# EAGLE design frontpanel_prototype (EAGLE 6.6.0)
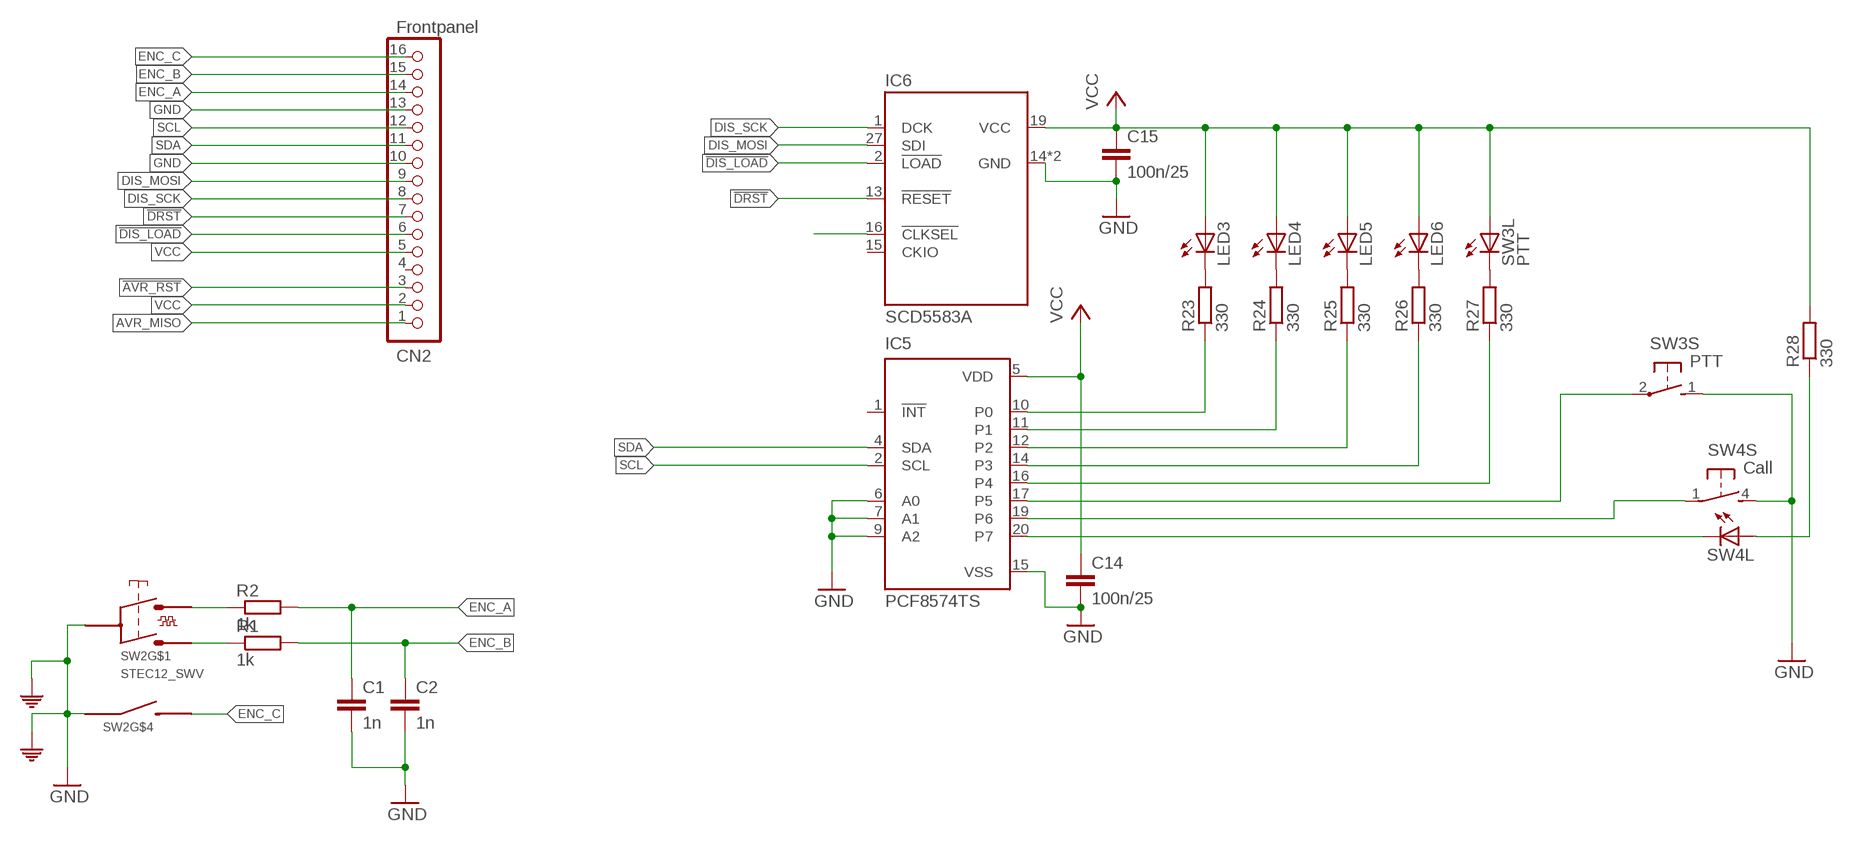
[diagram p0: schematic, sheet 1]

## Parts
C1  1n  C-EUC0603  [C0603]
C2  1n  C-EUC0603  [C0603]
C14  100n/25  C-EUC0603  [C0603]
C15  100n/25  C-EUC0603  [C0603]
CN2  Frontpanel  MOLEX-505278-1633  [MOLEX-505278-1633]
IC5  PCF8574TS  [SSOP20]
IC6  SCD5583A  [SCD558XA]
LED3  LEDLZR181  [LZR181]
LED4  LEDLZR181  [LZR181]
LED5  LEDLZR181  [LZR181]
LED6  LEDLZR181  [LZR181]
R1  1k  R-EU_R0603  [R0603]
R2  1k  R-EU_R0603  [R0603]
R23  330  R-EU_R0603  [R0603]
R24  330  R-EU_R0603  [R0603]
R25  330  R-EU_R0603  [R0603]
R26  330  R-EU_R0603  [R0603]
R27  330  R-EU_R0603  [R0603]
R28  330  R-EU_R0603  [R0603]
SW2  STEC12_SWV  [STEC12_VERT]
SW3  PTT  6425-0101  [6425]
SW4  Call  5GSH9_LED  [MEC_5G_LED]

## Nets
!AVR_RST!: CN2.3
!DIS_LOAD!: CN2.6 IC6.2(!LOAD!)
!DRST!: CN2.7 IC6.13(!RESET!)
AVR_MISO: CN2.1
DIS_MOSI: CN2.9 IC6.27(SDI)
DIS_SCK: CN2.8 IC6.1(DCK)
ENC_A: C1.1 CN2.14 R2.2
ENC_B: C2.1 CN2.15 R1.2
ENC_C: CN2.16 SW2.Y
GND: C1.2 C2.2 C14.2 C15.2 CN2.10 CN2.13 IC5.6(A0) IC5.7(A1) IC5.9(A2) IC5.15(VSS) IC6.14(GND) IC6.28(GND) SW2.B SW2.G1 SW2.G2 SW2.X SW3.1(S:S) SW4.4(S:S)
N$1: R2.1 SW2.A
N$2: R1.1 SW2.C
N$3: IC6.16(!CLKSEL!)
N$19: R27.2 SW3.K(L:C)
N$21: LED3.K(C) R23.2
N$26: R28.1 SW4.3(L:A)
N$27: IC5.19(P6) SW4.1(S:P)
N$29: IC5.20(P7) SW4.2(L:C)
N$30: IC5.17(P5) SW3.2(S:P)
N$39: LED4.K(C) R24.2
N$40: LED5.K(C) R25.2
N$41: LED6.K(C) R26.2
N$44: IC5.16(P4) R27.1
N$45: IC5.10(P0) R23.1
N$46: IC5.11(P1) R24.1
N$47: IC5.12(P2) R25.1
N$48: IC5.14(P3) R26.1
SCL: CN2.12 IC5.2(SCL)
SDA: CN2.11 IC5.4(SDA)
VCC: C14.1 C15.1 CN2.2 CN2.5 IC5.5(VDD) IC6.19(VCC) LED3.A LED4.A LED5.A LED6.A R28.2 SW3.A(L:A)
Unconnected: CN2.4 IC5.1(!INT) IC6.15(CKIO)

## Library data of the parts
C1 C2 C14 C15 = rcl:C-EU: CAPACITOR, European symbol
CN2 = mycon:MOLEX-505278-1633
IC5 = micro-philips:PCF8574: I2C-Bus Remote 8-bit I/O expander http://www.semiconductors.philips.com/acrobat_download/datasheets/PCF8574_4.pdf
IC6 = osram:SCD55
LED3-LED6 = led:LED: LED OSRAM: - CHIPLED LG R971, LG N971, LY N971, LG Q971, LY Q971, LO R971, LY R971 LH N974, LH R974 LS Q976, LO Q976, LY Q976 LO Q996 - Hyper CHIPLED LW Q18S LB Q993, LB Q99A, LB R99A - SideLED LS A670, LO A670, LY A670, LG A670, LP A670 LB A673, LV A673, LT A673, LW A673 LH A674 LY A675 LS A676, LA A676, LO A676, LY A676, LW A676 LS A679, LY A679, LG A679 - Hyper Micro SIDELED® LS Y876, LA Y876, LO Y876, LY Y876 LT Y87S - SmartLED LW L88C, LW L88S LB L89C, LB L89S, LG L890 LS L89K, LO L89K, LY L89K LS L896, LA L896, LO L896, LY L896 - TOPLED LS T670, LO T670, LY T670, LG T670, LP T670 LSG T670, LSP T670, LSY T670, LOP T670, LYG T670 LG T671, LOG T671, LSG T671 LB T673, LV T673, LT T673, LW T673 LH T674 LS T676, LA T676, LO T676, LY T676, LB T676, LH T676, LSB T676, LW T676 LB T67C, LV T67C, LT T67C, LS T67K, LO T67K, LY T67K, LW E67C LS E67B, LA E67B, LO E67B, LY E67B, LB E67C, LV E67C, LT E67C LW T67C LS T679, LY T679, LG T679 LS T770, LO T770, LY T770, LG T770, LP T770 LB T773, LV T773, LT T773, LW T773 LH T774 LS E675, LA E675, LY E675, LS T675 LS T776, LA T776, LO T776, LY T776, LB T776 LHGB T686 LT T68C, LB T68C - Hyper Mini TOPLED® LB M676 - Mini TOPLED Santana® LG M470 LS M47K, LO M47K, LY M47K Source: http://www.osram.convergy.de LUXEON: - LUMILED® LXK2-PW12-R00, LXK2-PW12-S00, LXK2-PW14-U00, LXK2-PW14-V00 LXK2-PM12-R00, LXK2-PM12-S00, LXK2-PM14-U00 LXK2-PE12-Q00, LXK2-PE12-R00, LXK2-PE12-S00, LXK2-PE14-T00, LXK2-PE14-U00 LXK2-PB12-K00, LXK2-PB12-L00, LXK2-PB12-M00, LXK2-PB14-N00, LXK2-PB14-P00, LXK2-PB14-Q00 LXK2-PR12-L00, LXK2-PR12-M00, LXK2-PR14-Q00, LXK2-PR14-R00 LXK2-PD12-Q00, LXK2-PD12-R00, LXK2-PD12-S00 LXK2-PH12-R00, LXK2-PH12-S00 LXK2-PL12-P00, LXK2-PL12-Q00, LXK2-PL12-R00 Source: www.luxeon.com KINGBRIGHT: KA-3528ASYC Source: www.kingbright.com
R1 R2 R23-R28 = rcl:R-EU_: RESISTOR, European symbol
SW2 = alps_encoder:STEC12_SW
SW3 = marquardt:6425-0101
SW4 = multimec:5GSH9_LED

## Board
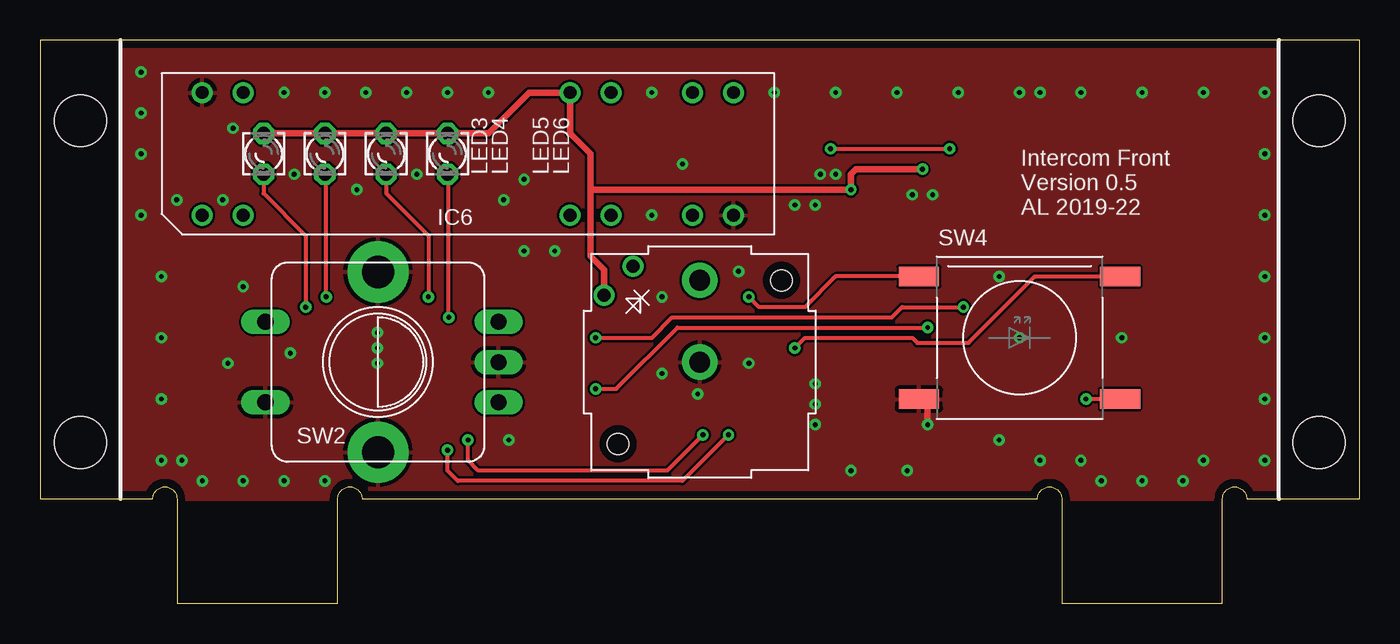
[diagram p1: board, top side]
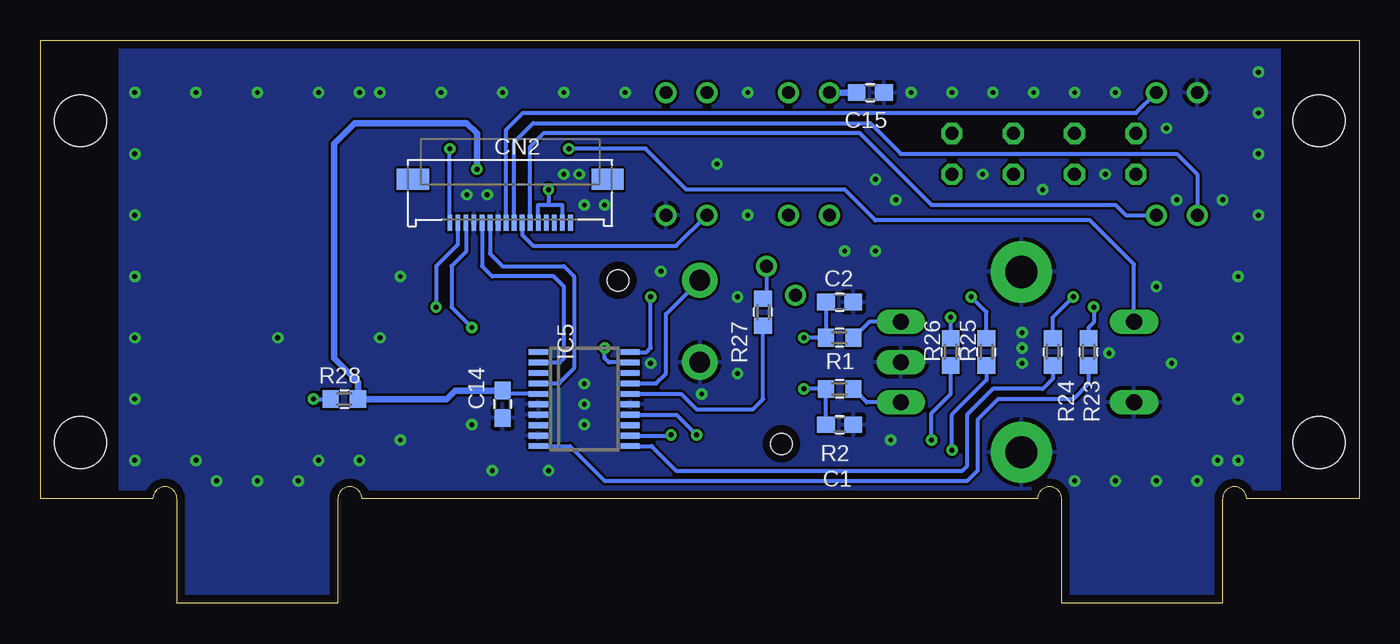
[diagram p2: board, bottom side, seen from below]

Size 82 x 35 mm. Coordinates in mm from the lower left corner, seen from the top.
Outline: 82,35 0,35 0,6.5 7,6.5 arc-90 7.75,7.25 arc-90 8.5,6.5 8.5,0 18.5,0 18.5,6.5 arc-90 19.25,7.25 arc-90 20,6.5 62,6.5 arc-90 62.75,7.25 arc-90 63.5,6.5 63.5,0 73.5,0 73.5,6.5 arc-90 74.25,7.25 arc-90 75,6.5 82,6.5 82,35
Copper layers (1*16): Top 0.035mm / dielectric 1.5mm / Bottom 0.035mm
Design rules "default *": minimum track width 6mil, minimum drill 0.3mm, track to track 6mil, track to pad 6mil, pad to pad 6mil, via to via 6mil, smd to smd 6mil, copper to edge 0.5mm, drill to drill 8mil, minimum pad ring 10mil, minimum via ring 8mil, stop-mask expansion 4mil, vias tented up to drill 0mil, thermal gap 10mil
Holes 3.2 mm at 2.5,30 2.5,10 79.5,30 79.5,10

### Footprints (pad centres in the part's own frame; a part is rotated, then mirrored left to right if it is on the bottom)
C0603 = smd 1.1 x 1: 1 -0.85,0; 2 0.85,0
MOLEX-505278-1633 = smd 0.3 x 1: 1 -3.75,1.75; 2 -3.25,1.75; 3 -2.75,1.75; 4 -2.25,1.75; 5 -1.75,1.75; 6 -1.25,1.75; 7 -0.75,1.75; 8 -0.25,1.75; 9 0.25,1.75; 10 0.75,1.75; 11 1.25,1.75; 12 1.75,1.75; 13 2.25,1.75; 14 2.75,1.75; 15 3.25,1.75; 16 3.75,1.75 | smd 2 x 1.3: T1 -6.05,-0.95; T2 6.05,-0.95
SSOP20 = smd 0.35 x 1.2: 1 -2.925,-2.85; 2 -2.275,-2.85; 3 -1.625,-2.85; 4 -0.975,-2.85; 5 -0.325,-2.85; 6 0.325,-2.85; 7 0.975,-2.85; 8 1.625,-2.85; 9 2.275,-2.85; 10 2.925,-2.85; 11 2.925,2.85; 12 2.275,2.85; 13 1.625,2.85; 14 0.975,2.85; 15 0.325,2.85; 16 -0.325,2.85; 17 -0.975,2.85; 18 -1.625,2.85; 19 -2.275,2.85; 20 -2.925,2.85
SCD558XA = drill 0.8: 1 -16.51,-3.81; 2 -13.97,-3.81; 10 6.35,-3.81; 11 8.89,-3.81; 13 13.97,-3.81; 14 16.51,-3.81; 15 16.51,3.81; 16 13.97,3.81; 18 8.89,3.81; 19 6.35,3.81; 27 -13.97,3.81; 28 -16.51,3.81
LZR181 = drill 0.813 octagon: A -1.27,0; K 1.27,0
R0603 = smd 1 x 1.1: 1 -0.85,0; 2 0.85,0
STEC12_VERT = drill 1 long: A -2.5,-7.5; B 0,-7.5; C 2.5,-7.5; X -2.5,7; Y 2.5,7 | drill 2 pad 3.81: G1 -5.6,0; G2 5.6,0
6425 = drill 1.3 pad 2.184: 1 0,0; 2 0,5.08 | drill 0.8: A -5.95,4.15; K -4.15,5.95 | hole 1.3: -5.08,-5.08; 5.08,5.08
MEC_5G_LED = smd 2.5 x 1.2: 1 6.25,3.81; 2 -6.25,3.81; 3 6.25,-3.81; 4 -6.25,-3.81

### Placement (x,y rotation side)
C1  32.3,11.11 0 bottom
C2  32.3,18.73 0 bottom
C14  53.26,12.38 270 bottom
C15  30.4,31.75 0 bottom
CN2  52.79,25.4 180 bottom
IC5  48.18,12.7 270 bottom
IC6  26.59,27.94 0 top
LED3  13.89,27.94 270 top
LED4  17.7,27.94 270 top
LED5  21.51,27.94 270 top
LED6  25.32,27.94 270 top
R1  32.3,16.51 180 bottom
R2  32.3,13.34 180 bottom
R23  16.83,15.64 90 bottom
R24  19.05,15.64 90 bottom
R25  23.18,15.64 90 bottom
R26  25.4,15.64 90 bottom
R27  37.07,18.1 90 bottom
R28  63.1,12.7 0 bottom
SW2  21,15 90 top
SW3  41,15 0 top
SW4  60.88,16.51 0 top

### Tracks (layer width: path | path; a pad name or v marks a point on that pad's centre or on a via)
!DIS_LOAD!
  Bottom 0.254: CN2.6 51.54,28.39 50.72,29.21 31.04,29.21 26.59,24.77 15.16,24.77 14.53,24.13 IC6.2
!DRST!
  Bottom 0.254: CN2.7 52.04,22.91 51.35,22.23 42.47,22.23 IC6.13
DIS_MOSI
  Bottom 0.254: CN2.9 53.04,29.43 51.99,30.48 13.89,30.48 IC6.27
DIS_SCK
  Bottom 0.254: CN2.8 52.54,28.66 51.35,29.84 30.4,29.84 28.5,27.94 11.35,27.94 10.08,26.67 IC6.1
ENC_A  (via drill 0.3)
  Top 0.254: v34.53,13.34 35.8,13.34 39.61,17.14 v55.16,17.14
  Bottom 0.254: C1.1 R2.2 v34.53,13.34 | CN2.14 55.54,21.85 56.44,20.95 56.44,18.41 v55.16,17.14
ENC_B  (via drill 0.3)
  Top 0.254: v34.53,16.51 38.02,16.51 39.29,17.78 52.94,17.78 53.58,18.41 v57.39,18.41
  Bottom 0.254: v34.53,16.51 R1.2 C2.1 | CN2.15 56.04,22.3 57.39,20.95 v57.39,18.41
ENC_C  (via drill 0.3)
  Top 0.254: v49.13,28.26 v56.54,28.26
  Bottom 0.254: SW2.Y 14,21.07 16.75,23.81 30.08,23.81 31.99,25.72 41.83,25.72 44.37,28.26 v49.13,28.26 | CN2.16 v56.54,28.26
GND  (via drill 0.3)
  Top 0.406: SW4.4 54.85,12.7 55.16,12.38 v55.16,11.11
  other vias: 10.08,7.62 12.62,7.62 15.16,7.62 17.7,7.62 29.13,10.16 38.66,14.29 38.66,19.05 43.42,20.64 40.88,13.02 44.05,14.92 48.18,13.65 48.18,12.38 48.18,11.11 50.4,8.26 53.9,8.26 65.96,7.62 68.5,7.62 71.04,7.62 67.23,16.51 60.88,16.51 59.61,20.32 59.61,10.16 54.21,25.4 55.48,25.4 48.5,26.67 49.45,26.67 48.18,24.77 46.91,24.77 39.92,27.3 38.02,24.13 30.08,26.35 30.08,21.91 31.99,21.91 28.81,25.08 23.41,26.67 15.79,26.67 11.98,29.53 11.35,25.08 6.27,27.94 6.27,30.48 6.27,33.02 15.16,31.75 17.7,31.75 20.24,31.75 22.78,31.75 25.32,31.75 27.86,31.75 38.02,31.75 45.64,31.75 49.45,31.75 53.26,31.75 57.07,31.75 62.15,31.75 60.88,31.75 64.69,31.75 68.5,31.75 72.31,31.75 76.12,31.75 76.12,27.94 76.12,24.13 76.12,20.32 76.12,16.51 76.12,12.7 76.12,8.89 72.31,8.89 64.69,8.89 62.15,8.89 7.54,8.89 8.81,8.89 12.62,19.68 11.67,14.92 7.54,12.7 8.49,25.08 19.68,25.72 20.95,14.92 20.95,15.88 20.95,16.83 15.56,15.56 7.54,16.51 7.54,20.32 6.27,24.13
  pour Bottom: 5,0 77,0 77,35 5,35
  pour Top: 5,6.5 77,6.5 77,35 5,35
N$1
  Bottom 0.254: SW2.A 30.62,12.5 R2.1
N$2
  Bottom 0.254: SW2.C 30.46,17.5 R1.1
N$19
  Bottom 0.254: SW3.K 36.85,19.16 R27.2
N$21  (via drill 0.3)
  Top 0.254: LED3.K 13.89,25.48 16.51,22.86 v16.51,18.41
  Bottom 0.254: v16.51,18.41 16.51,17.46 16.83,17.14 R23.2
N$26  (via drill 0.3)
  Top 0.254: SW4.3 v65.01,12.7
  Bottom 0.254: v65.01,12.7 R28.1
N$27  (via drill 0.3)
  Top 0.254: v46.91,15.88 47.55,16.51 54.21,16.51 54.53,16.19 57.7,16.19 61.83,20.32 SW4.1
  Bottom 0.254: IC5.19 46.65,14.97 46.91,15.24 v46.91,15.88
N$29  (via drill 0.3)
  Top 0.254: SW4.2 49.45,20.32 47.55,18.41 44.69,18.41 v44.05,19.05
  Bottom 0.254: IC5.20 44.3,15.62 44.05,15.88 v44.05,19.05
N$30
  Bottom 0.254: IC5.17 43.71,13.68 43.1,14.29 43.1,17.98 SW3.2
N$39  (via drill 0.3)
  Top 0.254: v17.78,19.05 17.78,26.59 LED4.K
  Bottom 0.254: R24.2 19.05,17.78 v17.78,19.05
N$40  (via drill 0.3)
  Top 0.254: LED5.K 21.51,25.48 24.13,22.86 v24.13,19.05
  Bottom 0.254: R25.2 23.18,18.1 v24.13,19.05
N$41  (via drill 0.3)
  Top 0.254: v25.4,17.78 25.4,26.59 LED6.K
  Bottom 0.254: R26.2 v25.4,17.78
N$44
  Bottom 0.254: IC5.16 42.16,13.03 41.2,12.06 37.7,12.06 37.07,12.7 R27.1
N$45
  Bottom 0.254: IC5.10 49.06,9.78 46.91,7.62 24.37,7.62 23.73,8.26 23.73,11.43 22.46,12.7 17.78,12.7 16.83,13.65 R23.1
N$46
  Bottom 0.254: IC5.11 43.98,9.78 42.47,8.26 24.68,8.26 24.37,8.57 24.37,11.75 22.78,13.34 19.68,13.34 19.05,13.97 R24.1
N$47  (via drill 0.3)
  Top 0.254: v42.78,10.48 39.92,7.62 25.95,7.62 25.32,8.26 v25.32,9.53
  Bottom 0.254: IC5.12 42.84,10.43 v42.78,10.48 | v25.32,9.53 25.32,11.75 23.18,13.89 R25.1
N$48  (via drill 0.3)
  Top 0.254: v41.2,10.48 38.97,8.26 27.23,8.26 26.59,8.89 v26.59,10.16
  Bottom 0.254: IC5.14 42.44,11.72 v41.2,10.48 | v26.59,10.16 26.59,11.83 25.4,13.02 R26.1
SCL
  Bottom 0.254: IC5.2 49.72,14.97 49.45,15.24 49.45,19.68 50.09,20.32 53.9,20.32 54.54,20.96 CN2.12
SDA
  Bottom 0.254: CN2.11 54.04,21.73 53.26,20.95 49.45,20.95 48.81,20.32 48.81,14.61 49.74,13.68 IC5.4
VCC  (via drill 0.3)
  Top 0.406: LED3.A LED4.A LED5.A LED6.A 27.86,29.21 30.4,31.75 IC6.19 32.94,29.21 34.21,27.94 34.21,25.72 | SW3.A 35.05,20.75 34.21,21.59 34.21,25.72 | v54.85,26.99 50.72,26.99 50.4,26.67 v50.4,25.72 34.21,25.72
  Bottom 0.254: CN2.2 49.54,24.77 50.4,24.77 | CN2.5 51.04,24.77 50.4,24.77 | v50.4,25.72 50.4,24.77 | IC5.5 53.05,13.03 C14.1
  Bottom 0.406: C14.1 56.22,13.23 56.75,12.7 R28.2 62.25,13.76 63.74,15.24 63.74,28.57 62.47,29.84 55.48,29.84 54.85,29.21 v54.85,26.99 | C15.1 IC6.19

### Text on the board
tPlace: Intercom Front / Version 0.5 / AL 2019-22